# Altium schematic sheet Diode Board.SchDoc
size A4
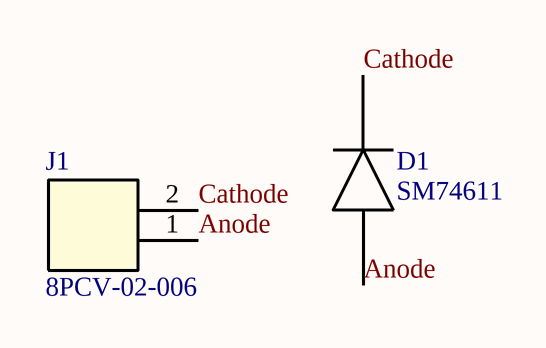
[diagram p0: Diode Board.SchDoc]

## Parts
D1  SM74611  [SM74611 Smart Bypass Diode - TI]
J1  8PCV-02-006  [CON2_1X2_P438R_B]

## Nets
Anode: D1.1 D1.3 J1.1
Cathode: D1.4 J1.2

## Library data of the parts
D1 = SM74611 Smart Bypass Diode - TI
J1 = 8PCV-02-006: Imported; Vendor: TE Connectivity; Built_By: EMA_UL_Team; C: Copyright (C) 2015 Accelerated Designs. All rights reserved; Manufacturer_Part_Number: 8PCV-02-006; Value: Value; Type: Type; RefDes: RefDes